# EAGLE design tetrad (EAGLE 7.7.0)

## Sheet 1 of 3: CPU
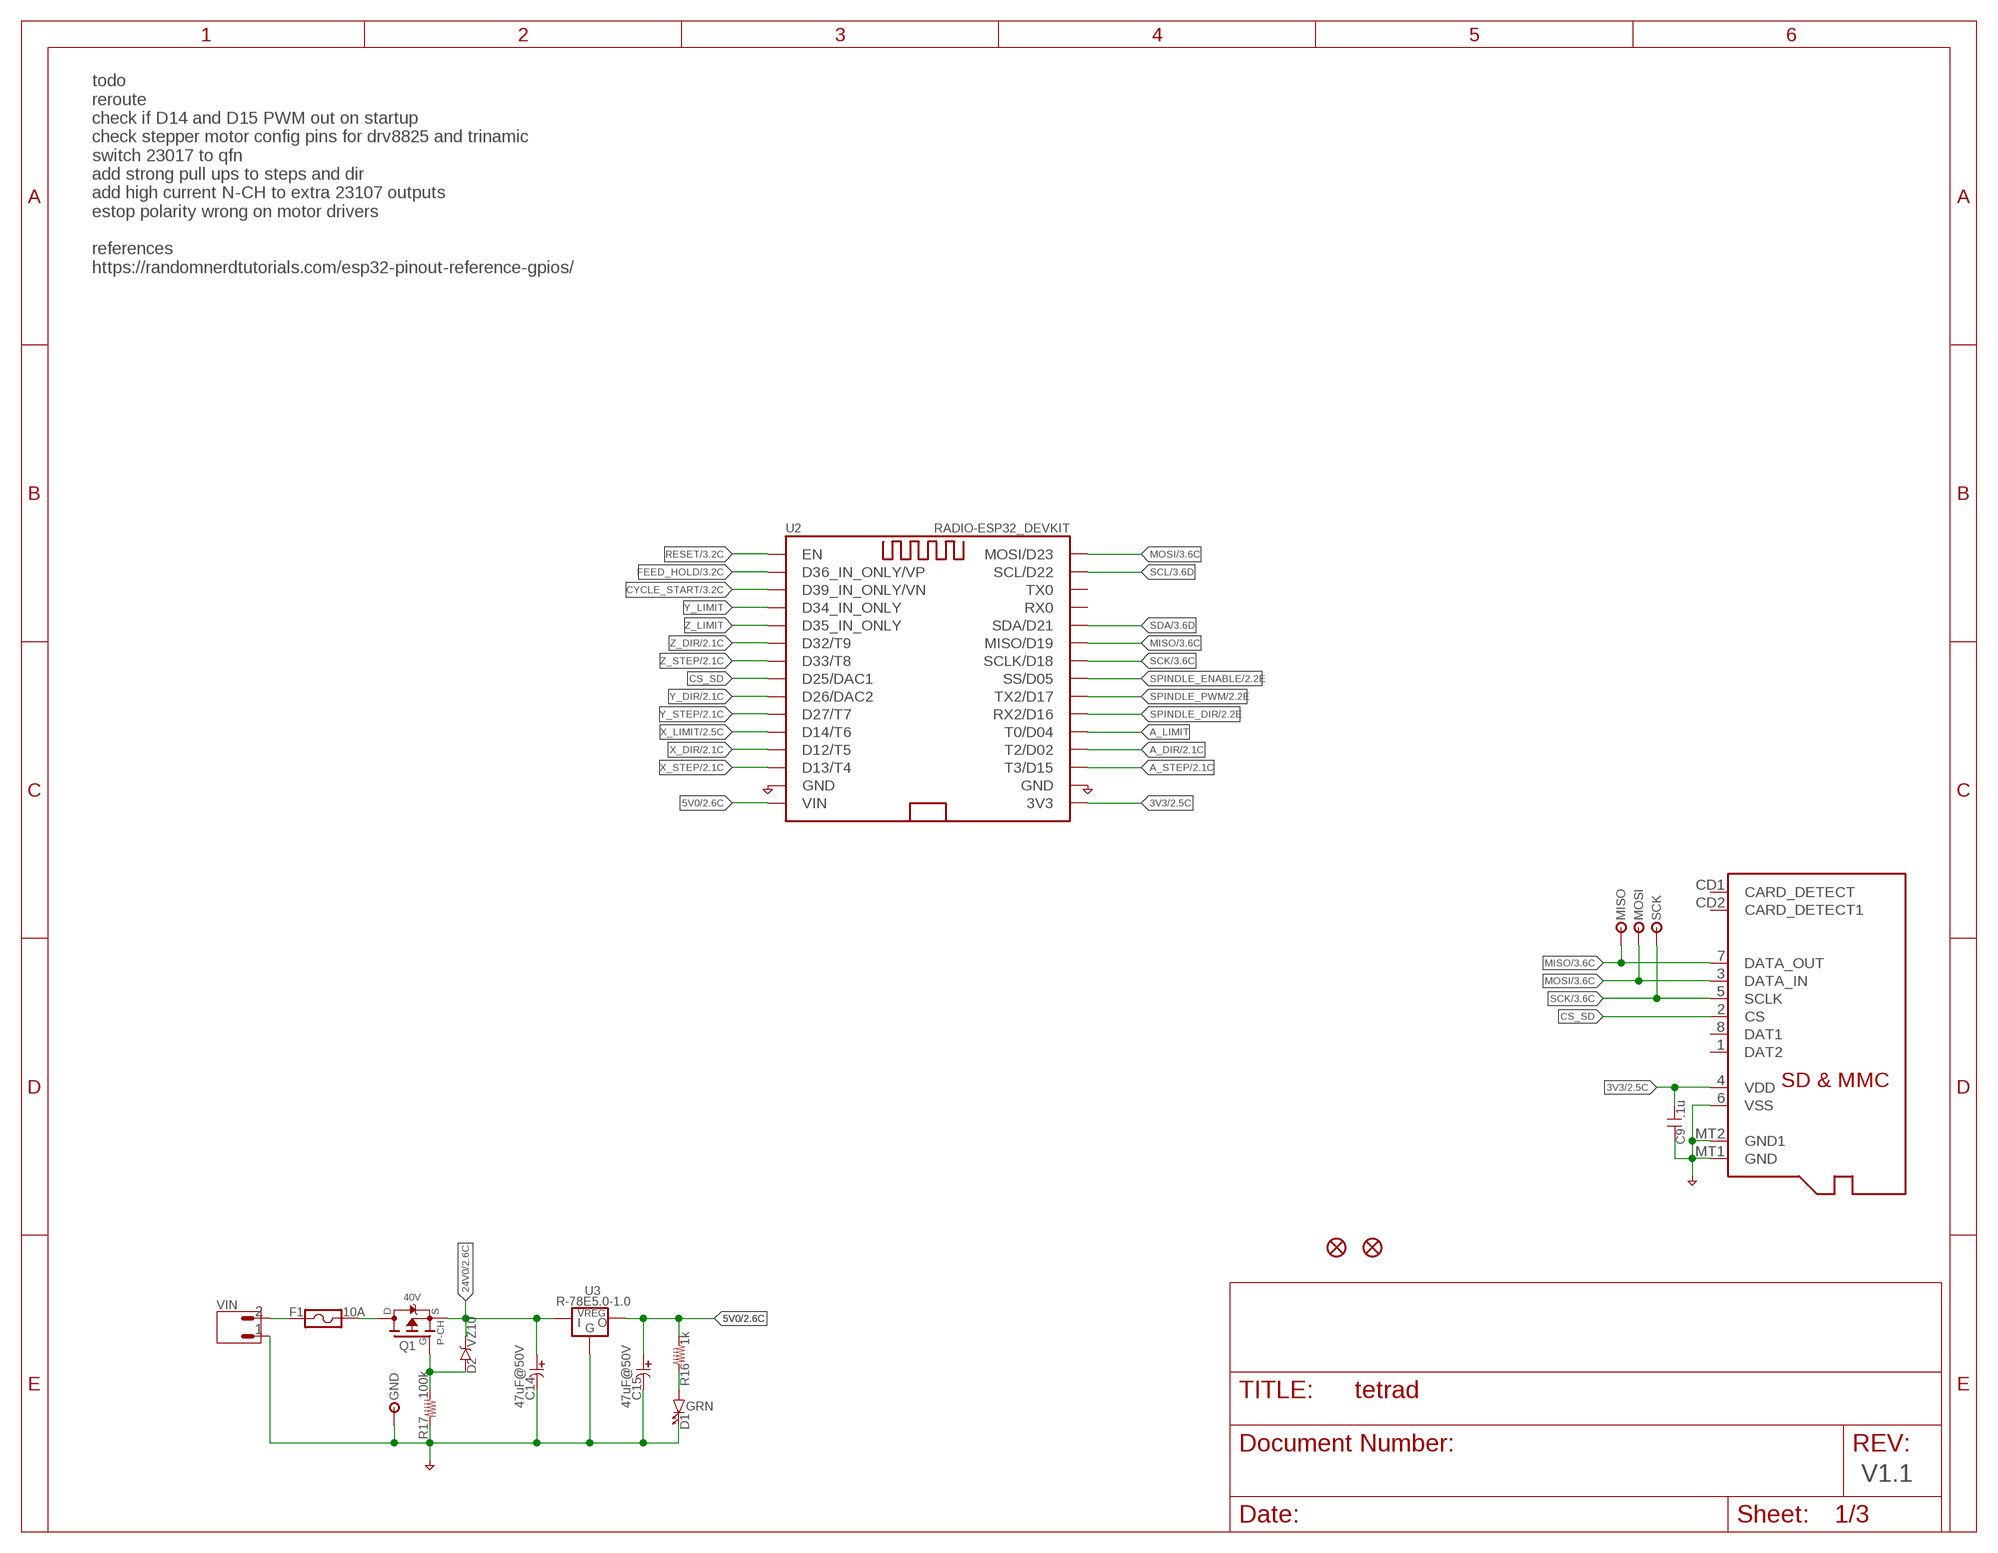
[diagram p0: schematic, sheet 1]

### Parts
C9  .1u  C-0603  [C-0603]
C14  47uF@50V  C-POLARIZED-E-6  [C-E-6]
C15  47uF@50V  C-POLARIZED-E-6  [C-E-6]
D1  GRN  LED-0603  [LED-0603]
D2  VZ10  DIODE-ZENER-SOD323  [D-SOD323]
F1  10A  FUSE-HOLDER-3557-2  [3557-2]
FID1  FIDUCIAL-MICRO  [FIDUCIAL-MICRO]
FID2  FIDUCIAL-MICRO  [FIDUCIAL-MICRO]
GND  TESTPOINTTHRU  [TPTHRU]
J1  CONN-MICROSD-2908-05WB-MG  [CONN-MICROSD-2908-05WB-MG]
MISO  TESTPOINTTHRU  [TPTHRU]
MOSI  TESTPOINTTHRU  [TPTHRU]
Q1  FET-PCH-TO252  [TO252]
R16  1k  R-0603  [R-0603]
R17  100k  R-0603  [R-0603]
SCK  TESTPOINTTHRU  [TPTHRU]
U2  RADIO-ESP32_DEVKIT  [ESP32_DEVKIT]
U3  R-78E5.0-1.0  VREG-SIP3  [VREG-SIP3]
VIN  CONN-02-3.81MM-PLUGIN-SCREW  [CONN-3.81MM-KF2EDG-2]

### Nets
3V3: C9.1 J1.4(VDD) U2.3V3 ; also sheet 2,3
5V0: C15.+ R16.2 U2.VIN U3.3(VOUT) ; also sheet 2,3
24V0: C14.+ D2.C Q1.2(S) U3.1(VIN) ; also sheet 2,3
A_DIR: U2.D2(T2/D02) ; also sheet 2
A_LIMIT: U2.D4(T0/D04)
A_STEP: U2.D15(T3/D15) ; also sheet 2
CS_SD: J1.2(CS) U2.D25(D25/DAC1)
CYCLE_START: U2.VN(D39_IN_ONLY/VN) ; also sheet 3
FEED_HOLD: U2.VP(D36_IN_ONLY/VP) ; also sheet 3
GND: C9.2 C14.- C15.- D1.C GND.1 J1.6(VSS) J1.MT1(GND) J1.MT2(GND1) R17.1 U2.GND@1(GND) U2.GND@2(GND) U3.2(GND) VIN.1 ; also sheet 2,3
MISO: J1.7(DATA_OUT) MISO.1 U2.D19(MISO/D19) ; also sheet 3
MOSI: J1.3(DATA_IN) MOSI.1 U2.D23(MOSI/D23) ; also sheet 3
N$1: F1.1@1 F1.1@2 VIN.2
N$24: D2.A Q1.1(G) R17.2
N$57: F1.2@1 F1.2@2 Q1.3(D)
N$84: D1.A R16.1
RESET: U2.EN ; also sheet 3
SCK: J1.5(SCLK) SCK.1 U2.D18(SCLK/D18) ; also sheet 3
SCL: U2.D22(SCL/D22) ; also sheet 3
SDA: U2.D21(SDA/D21) ; also sheet 3
SPINDLE_DIR: U2.RX2(RX2/D16) ; also sheet 2
SPINDLE_ENABLE: U2.D5(SS/D05) ; also sheet 2
SPINDLE_PWM: U2.TX2(TX2/D17) ; also sheet 2
X_DIR: U2.D12(D12/T5) ; also sheet 2
X_LIMIT: U2.D14(D14/T6) ; also sheet 2
X_STEP: U2.D13(D13/T4) ; also sheet 2
Y_DIR: U2.D26(D26/DAC2) ; also sheet 2
Y_LIMIT: U2.D34(D34_IN_ONLY)
Y_STEP: U2.D27(D27/T7) ; also sheet 2
Z_DIR: U2.D32(D32/T9) ; also sheet 2
Z_LIMIT: U2.D35(D35_IN_ONLY)
Z_STEP: U2.D33(D33/T8) ; also sheet 2
Unconnected: J1.1(DAT2) J1.8(DAT1) J1.CD1(CARD_DETECT) J1.CD2(CARD_DETECT1) U2.RX0 U2.TX0

### Notes on the sheet
- todo
  reroute
  check if D14 and D15 PWM out on startup
  check stepper motor config pins for drv8825 and trinamic
  switch 23017 to qfn
  add strong pull ups to steps and dir
  add high current N-CH to extra 23107 outputs
  estop polarity wrong on motor drivers
  
  references
  https://randomnerdtutorials.com/esp32-pinout-reference-gpios/
- 40V
- V1.1

## Sheet 2 of 3: MOTOR
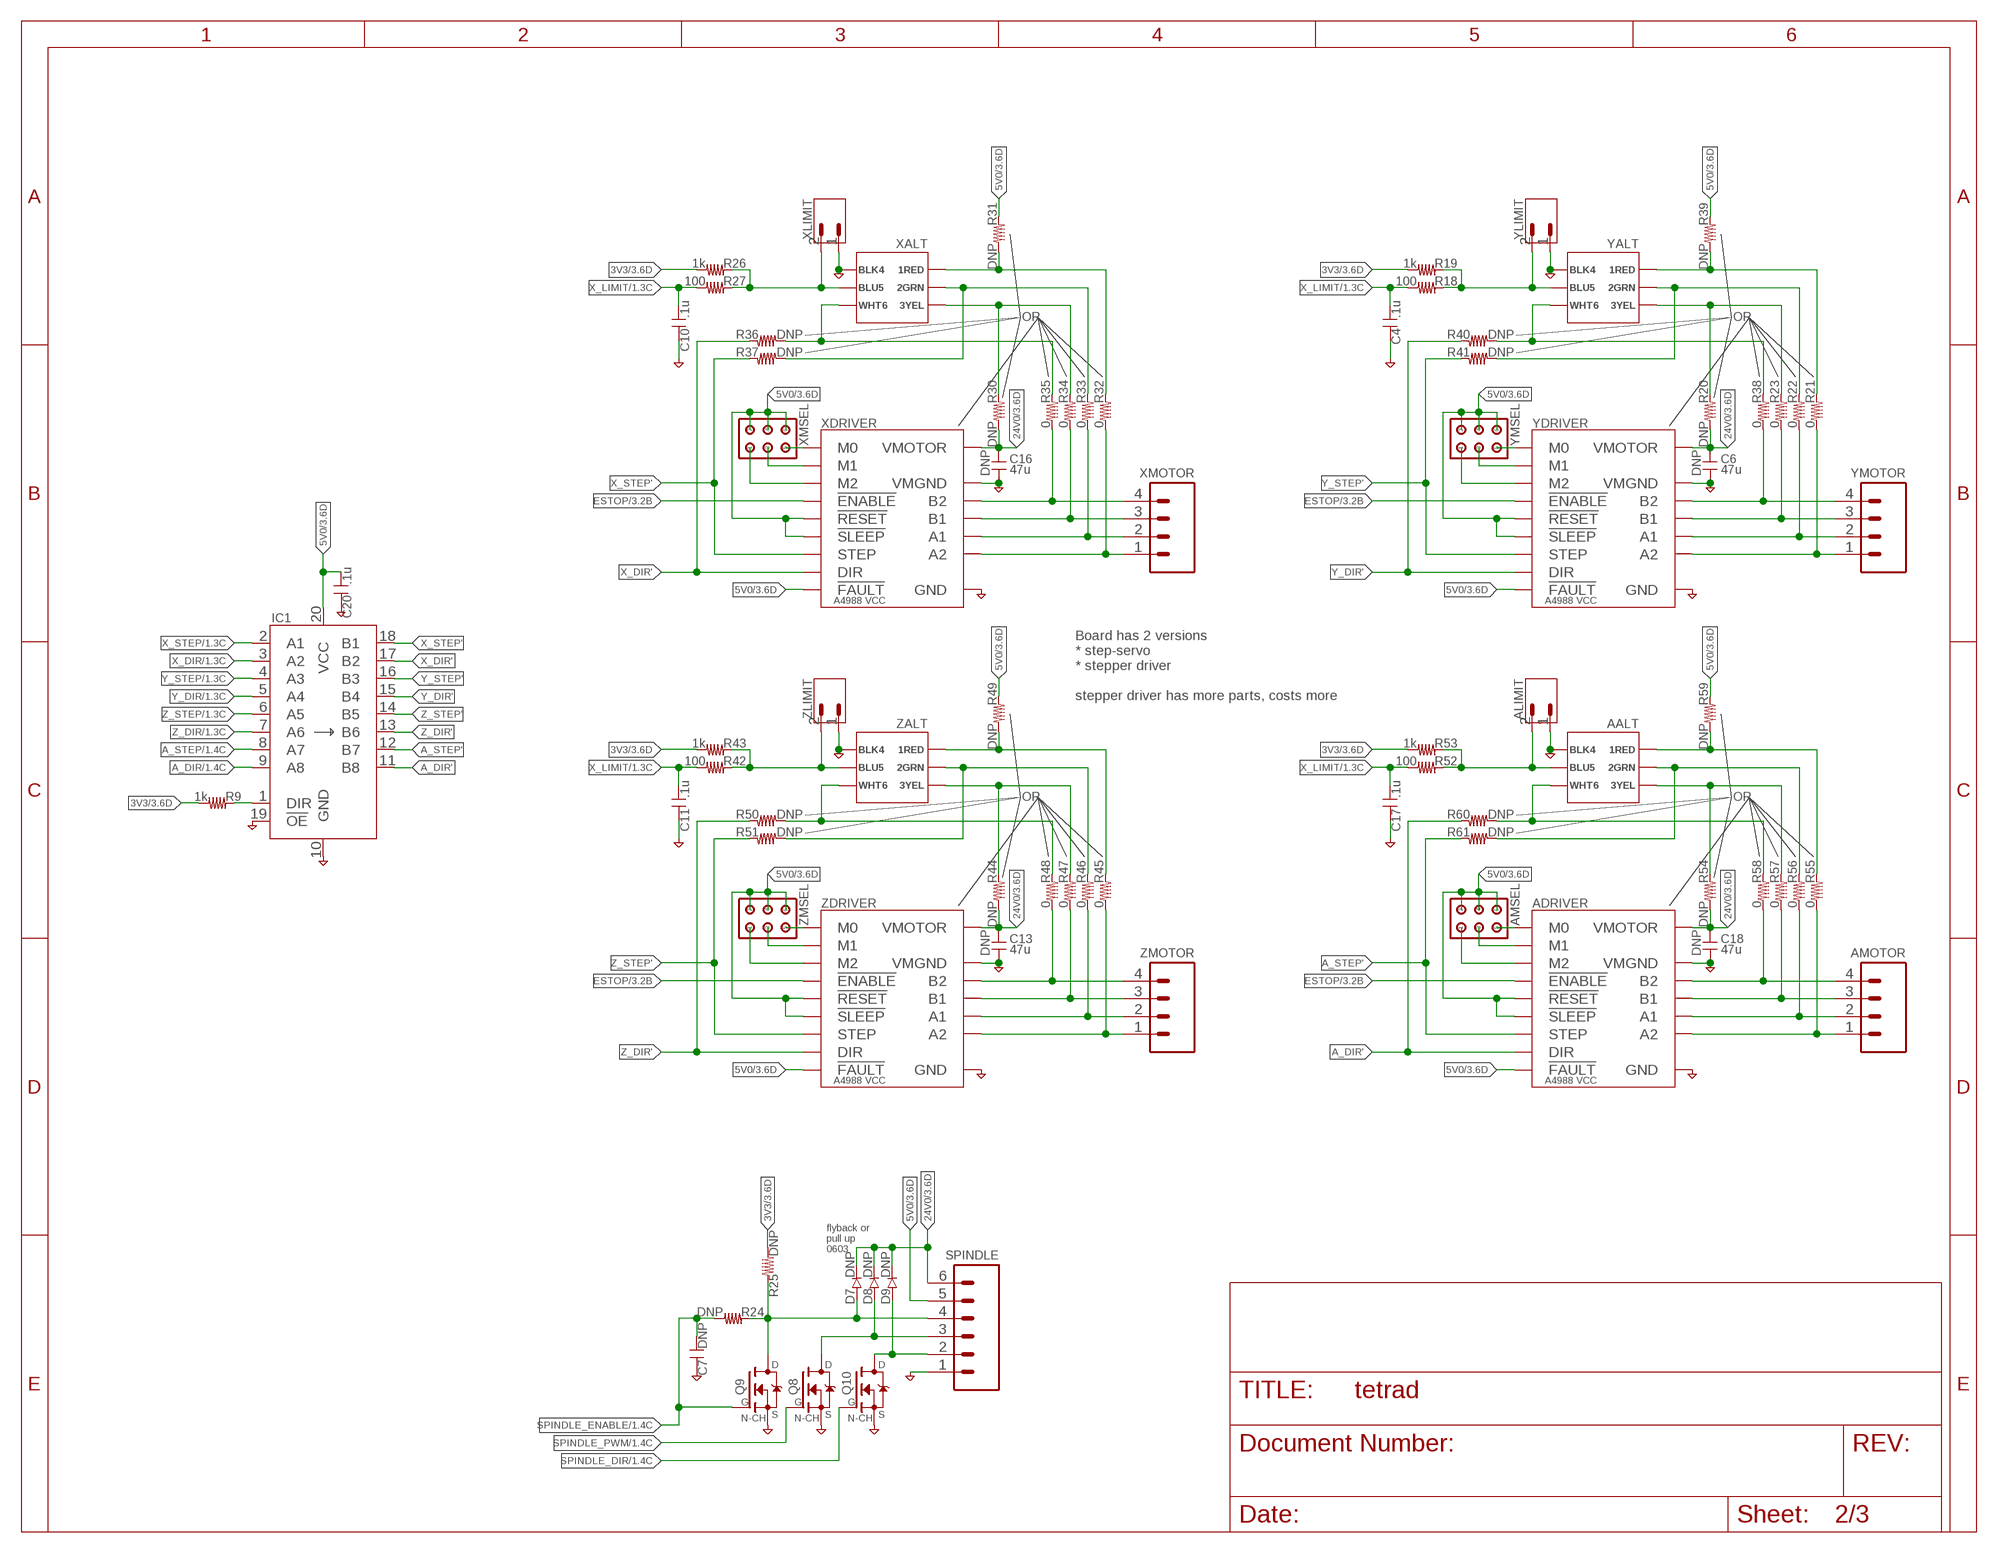
[diagram p1: schematic, sheet 2]

### Parts
AALT  CONN-03X2-MICROFIT-TH-SMD  [MOLEX_430450614_430450615]
ADRIVER  BOARD-DRV8825-CARRIER-TH-SMD  [IC_DRV8825_CARRIER_TH_SMD]
ALIMIT  CONN-02-.100-VERT-HEADER  [CONN-.100-2]
AMOTOR  CONN-04-.100-VERT-HEADER  [CONN-.100-4]
AMSEL  CONN-03X2-RH  [AMPHENOL_95278-101A06LF]
C4  .1u  C-0603  [C-0603]
C6  DNP  C-1206  [C-1206]
C7  DNP  C-0603  [C-0603]
C10  .1u  C-0603  [C-0603]
C11  .1u  C-0603  [C-0603]
C13  DNP  C-1206  [C-1206]
C16  DNP  C-1206  [C-1206]
C17  .1u  C-0603  [C-0603]
C18  DNP  C-1206  [C-1206]
C20  .1u  C-0603  [C-0603]
D7  DNP  DIODE-0603-SOD523  [D-SOD523]
D8  DNP  DIODE-0603-SOD523  [D-SOD523]
D9  DNP  DIODE-0603-SOD523  [D-SOD523]
IC1  74LS245DW  [SO20W]
Q8  FET-NCH-SOT23  [SOT23-3]
Q9  FET-NCH-SOT23  [SOT23-3]
Q10  FET-NCH-SOT23  [SOT23-3]
R9  1k  R-0603  [R-0603]
R18  100  R-0603  [R-0603]
R19  1k  R-0603  [R-0603]
R20  DNP  R-0603  [R-0603]
R21  0  R-0603  [R-0603]
R22  0  R-0603  [R-0603]
R23  0  R-0603  [R-0603]
R24  DNP  R-0603  [R-0603]
R25  DNP  R-0603  [R-0603]
R26  1k  R-0603  [R-0603]
R27  100  R-0603  [R-0603]
R30  DNP  R-0603  [R-0603]
R31  DNP  R-0603  [R-0603]
R32  0  R-0603  [R-0603]
R33  0  R-0603  [R-0603]
R34  0  R-0603  [R-0603]
R35  0  R-0603  [R-0603]
R36  DNP  R-0603  [R-0603]
R37  DNP  R-0603  [R-0603]
R38  0  R-0603  [R-0603]
R39  DNP  R-0603  [R-0603]
R40  DNP  R-0603  [R-0603]
R41  DNP  R-0603  [R-0603]
R42  100  R-0603  [R-0603]
R43  1k  R-0603  [R-0603]
R44  DNP  R-0603  [R-0603]
R45  0  R-0603  [R-0603]
R46  0  R-0603  [R-0603]
R47  0  R-0603  [R-0603]
R48  0  R-0603  [R-0603]
R49  DNP  R-0603  [R-0603]
R50  DNP  R-0603  [R-0603]
R51  DNP  R-0603  [R-0603]
R52  100  R-0603  [R-0603]
R53  1k  R-0603  [R-0603]
R54  DNP  R-0603  [R-0603]
R55  0  R-0603  [R-0603]
R56  0  R-0603  [R-0603]
R57  0  R-0603  [R-0603]
R58  0  R-0603  [R-0603]
R59  DNP  R-0603  [R-0603]
R60  DNP  R-0603  [R-0603]
R61  DNP  R-0603  [R-0603]
SPINDLE  CONN-06-.100-VERT-HEADER  [CONN-.100-6]
XALT  CONN-03X2-MICROFIT-TH-SMD  [MOLEX_430450614_430450615]
XDRIVER  BOARD-DRV8825-CARRIER-TH-SMD  [IC_DRV8825_CARRIER_TH_SMD]
XLIMIT  CONN-02-.100-VERT-HEADER  [CONN-.100-2]
XMOTOR  CONN-04-.100-VERT-HEADER  [CONN-.100-4]
XMSEL  CONN-03X2-RH  [AMPHENOL_95278-101A06LF]
YALT  CONN-03X2-MICROFIT-TH-SMD  [MOLEX_430450614_430450615]
YDRIVER  BOARD-DRV8825-CARRIER-TH-SMD  [IC_DRV8825_CARRIER_TH_SMD]
YLIMIT  CONN-02-.100-VERT-HEADER  [CONN-.100-2]
YMOTOR  CONN-04-.100-VERT-HEADER  [CONN-.100-4]
YMSEL  CONN-03X2-RH  [AMPHENOL_95278-101A06LF]
ZALT  CONN-03X2-MICROFIT-TH-SMD  [MOLEX_430450614_430450615]
ZDRIVER  BOARD-DRV8825-CARRIER-TH-SMD  [IC_DRV8825_CARRIER_TH_SMD]
ZLIMIT  CONN-02-.100-VERT-HEADER  [CONN-.100-2]
ZMOTOR  CONN-04-.100-VERT-HEADER  [CONN-.100-4]
ZMSEL  CONN-03X2-RH  [AMPHENOL_95278-101A06LF]

### Nets
3V3: R9.2 R19.2 R25.2 R26.2 R43.2 R53.2 ; also sheet 1,3
5V0: ADRIVER.5(!RESET) ADRIVER.5_(!RESET) ADRIVER.6(!SLEEP) ADRIVER.6_(!SLEEP) ADRIVER.10(!FAULT) ADRIVER.10_(!FAULT) AMSEL.2 AMSEL.4 AMSEL.6 C20.1 IC1.20(VCC) R31.1 R39.1 R49.1 R59.1 SPINDLE.5 XDRIVER.5(!RESET) XDRIVER.5_(!RESET) XDRIVER.6(!SLEEP) XDRIVER.6_(!SLEEP) XDRIVER.10(!FAULT) XDRIVER.10_(!FAULT) XMSEL.2 XMSEL.4 XMSEL.6 YDRIVER.5(!RESET) YDRIVER.5_(!RESET) YDRIVER.6(!SLEEP) YDRIVER.6_(!SLEEP) YDRIVER.10(!FAULT) YDRIVER.10_(!FAULT) YMSEL.2 YMSEL.4 YMSEL.6 ZDRIVER.5(!RESET) ZDRIVER.5_(!RESET) ZDRIVER.6(!SLEEP) ZDRIVER.6_(!SLEEP) ZDRIVER.10(!FAULT) ZDRIVER.10_(!FAULT) ZMSEL.2 ZMSEL.4 ZMSEL.6 ; also sheet 1,3
24V0: ADRIVER.16(VMOTOR) ADRIVER.16_(VMOTOR) C6.1 C13.1 C16.1 C18.1 D7.C D8.C D9.C R20.2 R30.2 R44.2 R54.2 SPINDLE.6 XDRIVER.16(VMOTOR) XDRIVER.16_(VMOTOR) YDRIVER.16(VMOTOR) YDRIVER.16_(VMOTOR) ZDRIVER.16(VMOTOR) ZDRIVER.16_(VMOTOR) ; also sheet 1,3
A_DIR: IC1.9(A8) ; also sheet 1
A_DIR': ADRIVER.8(DIR) ADRIVER.8_(DIR) IC1.11(B8) R60.1
A_STEP: IC1.8(A7) ; also sheet 1
A_STEP': ADRIVER.7(STEP) ADRIVER.7_(STEP) IC1.12(B7) R61.1
ESTOP: ADRIVER.1(!ENABLE) ADRIVER.1_(!ENABLE) XDRIVER.1(!ENABLE) XDRIVER.1_(!ENABLE) YDRIVER.1(!ENABLE) YDRIVER.1_(!ENABLE) ZDRIVER.1(!ENABLE) ZDRIVER.1_(!ENABLE) ; also sheet 3
GND: AALT.4 AALT.4_ ADRIVER.9(GND) ADRIVER.9_(GND) ADRIVER.15(VMGND) ADRIVER.15_(VMGND) ALIMIT.1 C4.2 C6.2 C7.2 C10.2 C11.2 C13.2 C16.2 C17.2 C18.2 C20.2 IC1.10(GND) IC1.19(!OE) Q8.2(S) Q9.2(S) Q10.2(S) SPINDLE.1 XALT.4 XALT.4_ XDRIVER.9(GND) XDRIVER.9_(GND) XDRIVER.15(VMGND) XDRIVER.15_(VMGND) XLIMIT.1 YALT.4 YALT.4_ YDRIVER.9(GND) YDRIVER.9_(GND) YDRIVER.15(VMGND) YDRIVER.15_(VMGND) YLIMIT.1 ZALT.4 ZALT.4_ ZDRIVER.9(GND) ZDRIVER.9_(GND) ZDRIVER.15(VMGND) ZDRIVER.15_(VMGND) ZLIMIT.1 ; also sheet 1,3
N$2: R30.1 R34.1 XALT.3 XALT.3_
N$3: IC1.1(DIR) R9.1
N$5: R31.2 R32.1 XALT.1 XALT.1_
N$6: R21.2 YDRIVER.11(A2) YDRIVER.11_(A2) YMOTOR.1
N$7: YDRIVER.2(M0) YDRIVER.2_(M0) YMSEL.5
N$8: YDRIVER.3(M1) YDRIVER.3_(M1) YMSEL.3
N$9: YDRIVER.4(M2) YDRIVER.4_(M2) YMSEL.1
N$10: R22.2 YDRIVER.12(A1) YDRIVER.12_(A1) YMOTOR.2
N$11: R23.2 YDRIVER.13(B1) YDRIVER.13_(B1) YMOTOR.3
N$13: D7.A Q9.3(D) R24.1 R25.1 SPINDLE.4
N$14: D9.A Q10.3(D) SPINDLE.2
N$21: R38.2 YDRIVER.14(B2) YDRIVER.14_(B2) YMOTOR.4
N$25: R32.2 XDRIVER.11(A2) XDRIVER.11_(A2) XMOTOR.1
N$31: R18.1 R19.1 YALT.5 YALT.5_ YLIMIT.2
N$33: XDRIVER.2(M0) XDRIVER.2_(M0) XMSEL.5
N$34: XDRIVER.3(M1) XDRIVER.3_(M1) XMSEL.3
N$35: XDRIVER.4(M2) XDRIVER.4_(M2) XMSEL.1
N$36: R38.1 R40.2 YALT.6 YALT.6_
N$37: R21.1 R39.2 YALT.1 YALT.1_
N$38: R20.1 R23.1 YALT.3 YALT.3_
N$39: R45.2 ZDRIVER.11(A2) ZDRIVER.11_(A2) ZMOTOR.1
N$40: ZDRIVER.2(M0) ZDRIVER.2_(M0) ZMSEL.5
N$41: ZDRIVER.3(M1) ZDRIVER.3_(M1) ZMSEL.3
N$42: ZDRIVER.4(M2) ZDRIVER.4_(M2) ZMSEL.1
N$43: R46.2 ZDRIVER.12(A1) ZDRIVER.12_(A1) ZMOTOR.2
N$45: R47.2 ZDRIVER.13(B1) ZDRIVER.13_(B1) ZMOTOR.3
N$46: R48.2 ZDRIVER.14(B2) ZDRIVER.14_(B2) ZMOTOR.4
N$47: R42.1 R43.1 ZALT.5 ZALT.5_ ZLIMIT.2
N$48: R48.1 R50.2 ZALT.6 ZALT.6_
N$49: R45.1 R49.2 ZALT.1 ZALT.1_
N$50: R44.1 R47.1 ZALT.3 ZALT.3_
N$51: ADRIVER.11(A2) ADRIVER.11_(A2) AMOTOR.1 R55.2
N$56: R35.2 XDRIVER.14(B2) XDRIVER.14_(B2) XMOTOR.4
N$58: R26.1 R27.1 XALT.5 XALT.5_ XLIMIT.2
N$59: ADRIVER.2(M0) ADRIVER.2_(M0) AMSEL.5
N$60: R35.1 R36.2 XALT.6 XALT.6_
N$61: ADRIVER.3(M1) ADRIVER.3_(M1) AMSEL.3
N$62: R33.2 XDRIVER.12(A1) XDRIVER.12_(A1) XMOTOR.2
N$63: R34.2 XDRIVER.13(B1) XDRIVER.13_(B1) XMOTOR.3
N$64: ADRIVER.4(M2) ADRIVER.4_(M2) AMSEL.1
N$65: ADRIVER.12(A1) ADRIVER.12_(A1) AMOTOR.2 R56.2
N$66: ADRIVER.13(B1) ADRIVER.13_(B1) AMOTOR.3 R57.2
N$67: ADRIVER.14(B2) ADRIVER.14_(B2) AMOTOR.4 R58.2
N$68: AALT.5 AALT.5_ ALIMIT.2 R52.1 R53.1
N$69: AALT.6 AALT.6_ R58.1 R60.2
N$70: AALT.1 AALT.1_ R55.1 R59.2
N$71: AALT.3 AALT.3_ R54.1 R57.1
SPINDLE_DIR: Q10.1(G) ; also sheet 1
SPINDLE_ENABLE: C7.1 Q9.1(G) R24.2 ; also sheet 1
SPINDLE_PWM: Q8.1(G) ; also sheet 1
X_DIR: IC1.3(A2) ; also sheet 1
X_DIR': IC1.17(B2) R36.1 XDRIVER.8(DIR) XDRIVER.8_(DIR)
X_LIMIT: C4.1 C10.1 C11.1 C17.1 R18.2 R27.2 R42.2 R52.2 ; also sheet 1
X_STEP: IC1.2(A1) ; also sheet 1
X_STEP': IC1.18(B1) R22.1 R33.1 R37.1 R37.2 R41.2 R46.1 R51.2 XALT.2 XALT.2_ XDRIVER.7(STEP) XDRIVER.7_(STEP) YALT.2 YALT.2_ ZALT.2 ZALT.2_
X_STEP'1: AALT.2 AALT.2_ R56.1 R61.2
X_STEP_5V4: D8.A Q8.3(D) SPINDLE.3
Y_DIR: IC1.5(A4) ; also sheet 1
Y_DIR': IC1.15(B4) R40.1 YDRIVER.8(DIR) YDRIVER.8_(DIR)
Y_STEP: IC1.4(A3) ; also sheet 1
Y_STEP': IC1.16(B3) R41.1 YDRIVER.7(STEP) YDRIVER.7_(STEP)
Z_DIR: IC1.7(A6) ; also sheet 1
Z_DIR': IC1.13(B6) R50.1 ZDRIVER.8(DIR) ZDRIVER.8_(DIR)
Z_STEP: IC1.6(A5) ; also sheet 1
Z_STEP': IC1.14(B5) R51.1 ZDRIVER.7(STEP) ZDRIVER.7_(STEP)

### Notes on the sheet
- OR | OR
- 47u | 47u
- Board has 2 versions
  * step-servo
  * stepper driver
  
  stepper driver has more parts, costs more
- OR | OR
- 47u | 47u
- flyback or
  pull up 
  0603

## Sheet 3 of 3: EXTERNAL
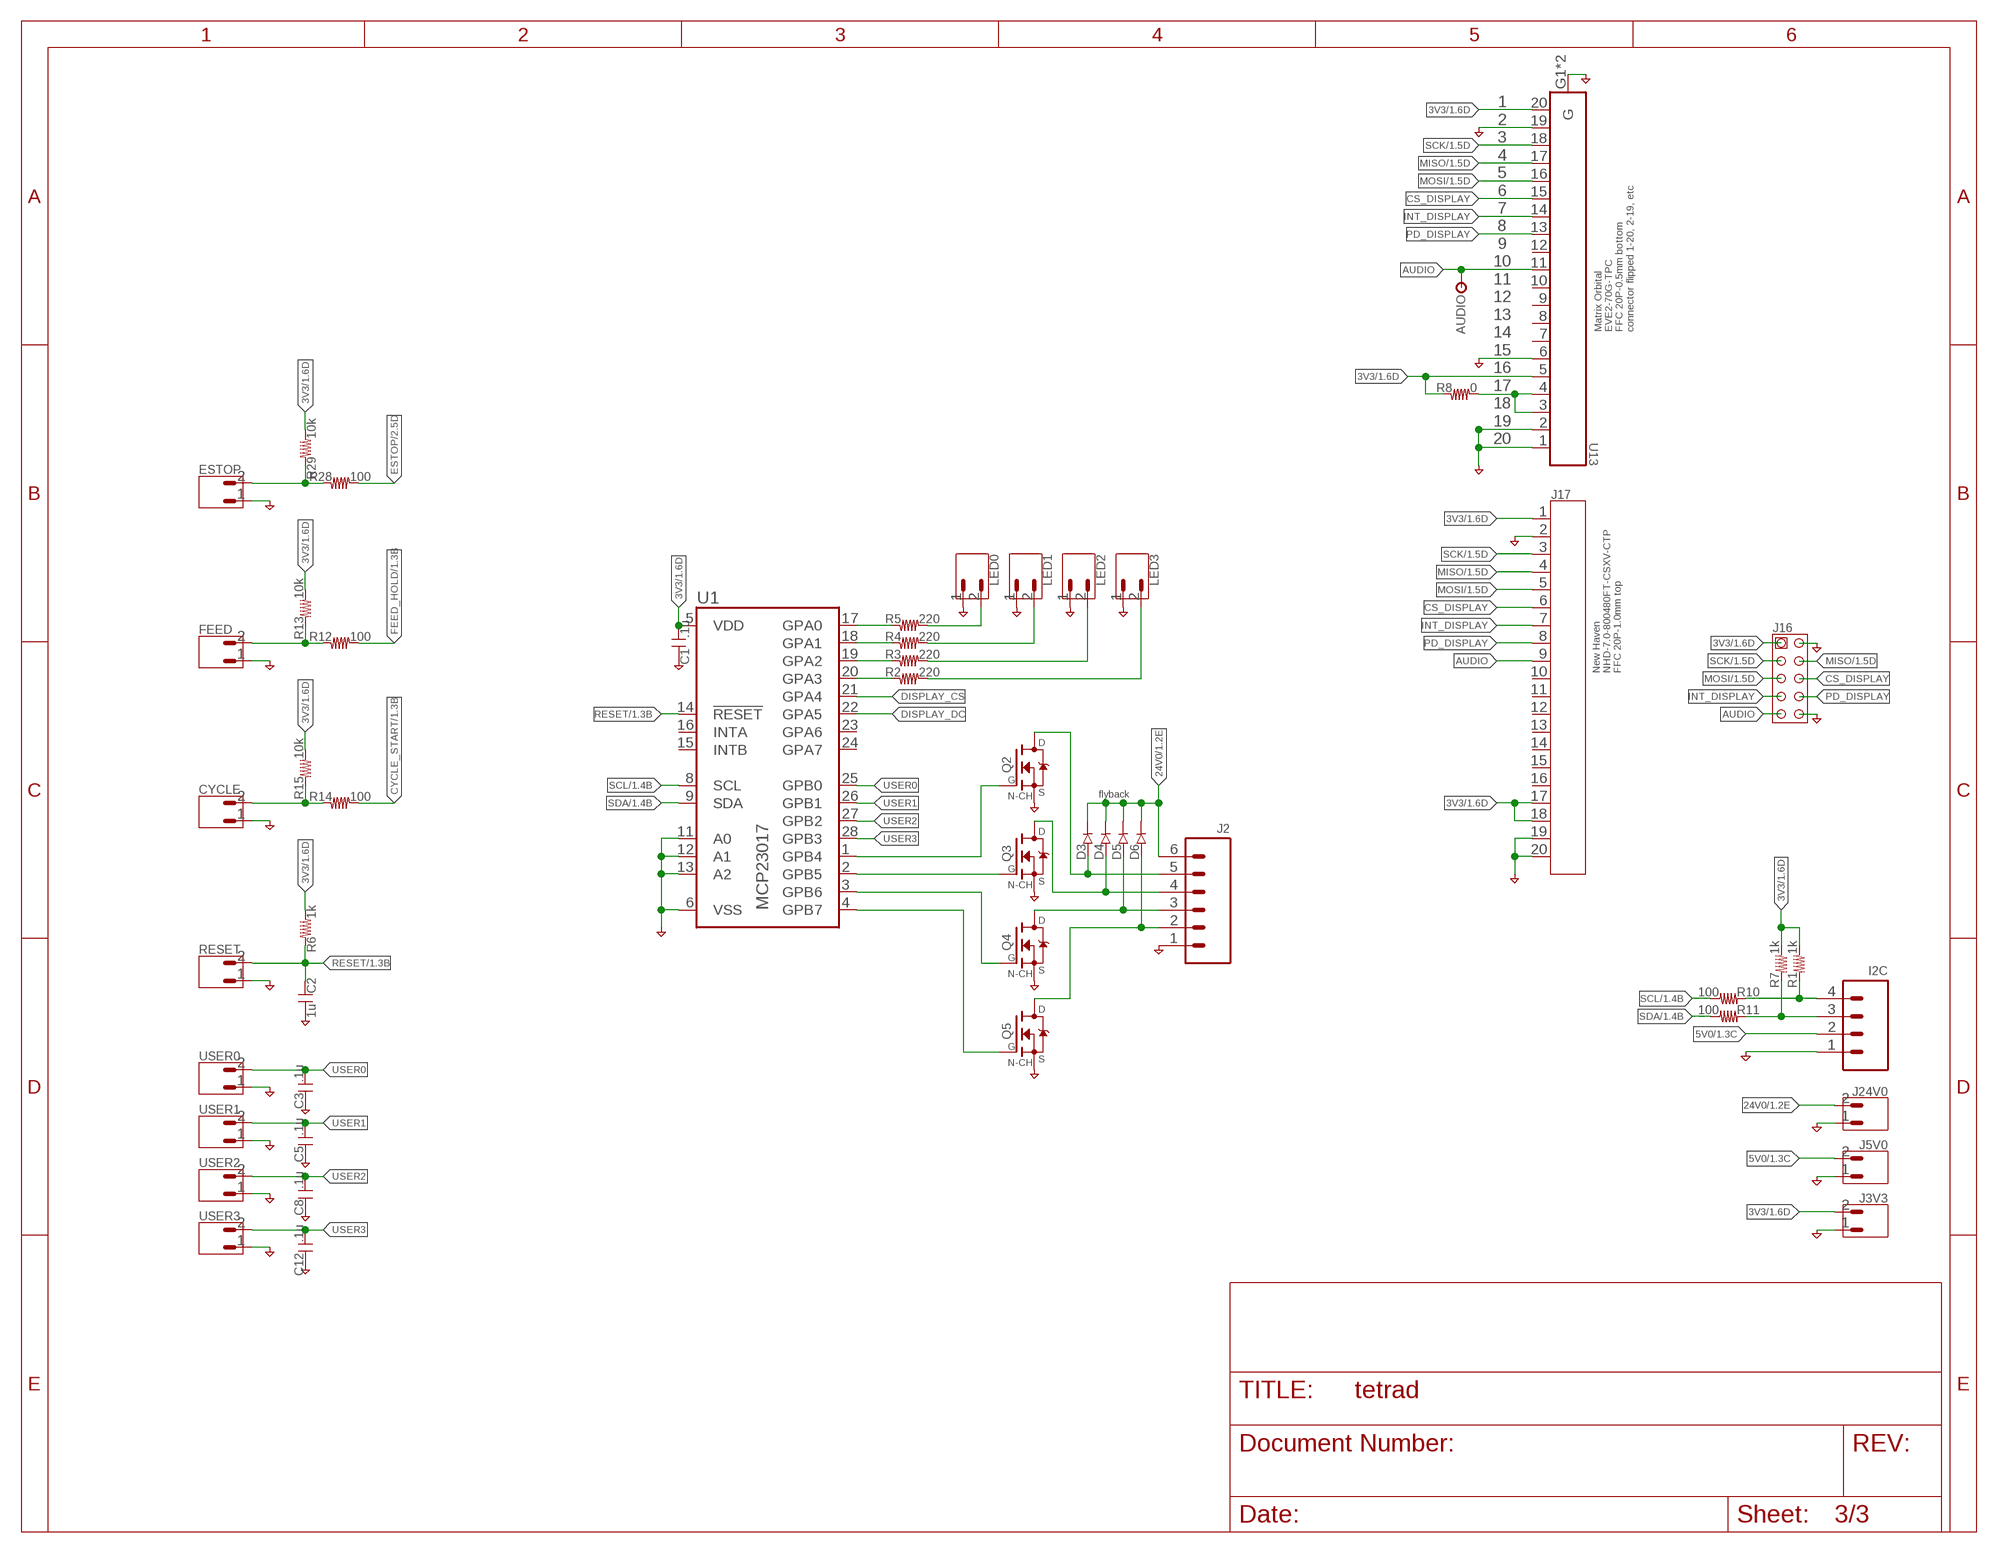
[diagram p2: schematic, sheet 3]

### Parts
AUDIO  TESTPOINTTHRU  [TPTHRU]
C1  .1u  C-0603  [C-0603]
C2  1u  C-0603  [C-0603]
C3  .1u  C-0603  [C-0603]
C5  .1u  C-0603  [C-0603]
C8  .1u  C-0603  [C-0603]
C12  .1u  C-0603  [C-0603]
CYCLE  CONN-02-.100-VERT-HEADER  [CONN-.100-2]
D3  DIODE-0603-SOD523  [D-SOD523]
D4  DIODE-0603-SOD523  [D-SOD523]
D5  DIODE-0603-SOD523  [D-SOD523]
D6  DIODE-0603-SOD523  [D-SOD523]
ESTOP  CONN-02-.100-VERT-HEADER  [CONN-.100-2]
FEED  CONN-02-.100-VERT-HEADER  [CONN-.100-2]
I2C  CONN-04-.100-VERT-HEADER  [CONN-.100-4]
J2  CONN-06-3.81MM-PLUGIN-SCREW  [CONN-3.81MM-KF2EDG-6]
J3V3  CONN-02-.100-VERT-HEADER  [CONN-.100-2]
J5V0  CONN-02-.100-VERT-HEADER  [CONN-.100-2]
J16  CONN-05X2-SHD  [2X5-SHROUDED]
J17  CONN-20-2-84952-0  [CON20_SMT-RA_FCC-FPC2]
J24V0  CONN-02-.100-VERT-HEADER  [CONN-.100-2]
LED0  CONN-02-.100-VERT-HEADER  [CONN-.100-2]
LED1  CONN-02-.100-VERT-HEADER  [CONN-.100-2]
LED2  CONN-02-.100-VERT-HEADER  [CONN-.100-2]
LED3  CONN-02-.100-VERT-HEADER  [CONN-.100-2]
Q2  FET-NCH-TO252  [TO252]
Q3  FET-NCH-TO252  [TO252]
Q4  FET-NCH-TO252  [TO252]
Q5  FET-NCH-TO252  [TO252]
R1  1k  R-0603  [R-0603]
R2  220  R-0603  [R-0603]
R3  220  R-0603  [R-0603]
R4  220  R-0603  [R-0603]
R5  220  R-0603  [R-0603]
R6  1k  R-0603  [R-0603]
R7  1k  R-0603  [R-0603]
R8  0  R-0603  [R-0603]
R10  100  R-0603  [R-0603]
R11  100  R-0603  [R-0603]
R12  100  R-0603  [R-0603]
R13  10k  R-0603  [R-0603]
R14  100  R-0603  [R-0603]
R15  10k  R-0603  [R-0603]
R28  100  R-0603  [R-0603]
R29  10k  R-0603  [R-0603]
RESET  CONN-02-.100-VERT-HEADER  [CONN-.100-2]
U1  IO-MCP23017ML  [QFN28-ML_6X6MM]
U13  CONN-20-FPC-0.50MM-10051922-2010ELF  [FCI_10051922-2010ELF]
USER0  CONN-02-.100-VERT-HEADER  [CONN-.100-2]
USER1  CONN-02-.100-VERT-HEADER  [CONN-.100-2]
USER2  CONN-02-.100-VERT-HEADER  [CONN-.100-2]
USER3  CONN-02-.100-VERT-HEADER  [CONN-.100-2]

### Nets
3V3: C1.1 J3V3.2 J16.1 J17.1 J17.17 J17.18 R1.2 R6.2 R7.2 R8.1 R13.2 R15.2 R29.2 U1.5(VDD) U13.5 U13.20 ; also sheet 1,2
5V0: I2C.2 J5V0.2 ; also sheet 1,2
24V0: D3.C D4.C D5.C D6.C J2.6 J24V0.2 ; also sheet 1,2
AUDIO: AUDIO.1 J16.9 J17.9 U13.11
CS_DISPLAY: J16.6 J17.6 U13.15
CYCLE_START: R14.2 ; also sheet 1
DISPLAY_CS: U1.21(GPA4)
DISPLAY_DC: U1.22(GPA5)
ESTOP: ESTOP.2 R28.1 R29.1 ; also sheet 2
FEED_HOLD: R12.2 ; also sheet 1
GND: C1.2 C2.1 C3.2 C5.2 C8.2 C12.2 CYCLE.1 ESTOP.1 FEED.1 I2C.1 J2.1 J3V3.1 J5V0.1 J16.2 J16.10 J17.2 J17.19 J17.20 J24V0.1 LED0.1 LED1.1 LED2.1 LED3.1 Q2.2(S) Q3.2(S) Q4.2(S) Q5.2(S) RESET.1 U1.6(VSS) U1.11(A0) U1.12(A1) U1.13(A2) U13.1 U13.2 U13.6 U13.19 U13.G1(G) U13.G2(G) USER0.1 USER1.1 USER2.1 USER3.1 ; also sheet 1,2
INT_DISPLAY: J16.7 J17.7 U13.14
MISO: J16.4 J17.4 U13.17 ; also sheet 1
MOSI: J16.5 J17.5 U13.16 ; also sheet 1
N$4: R28.2
N$12: R5.1 U1.17(GPA0)
N$15: R4.1 U1.18(GPA1)
N$16: FEED.2 R12.1 R13.1
N$17: CYCLE.2 R14.1 R15.1
N$18: I2C.4 R1.1 R10.1
N$19: I2C.3 R7.1 R11.1
N$20: D6.A J2.2 Q5.3(D)
N$22: R3.1 U1.19(GPA2)
N$23: R2.1 U1.20(GPA3)
N$26: LED3.2 R2.2
N$27: LED2.2 R3.2
N$28: LED1.2 R4.2
N$29: LED0.2 R5.2
N$30: D5.A J2.3 Q4.3(D)
N$32: D4.A J2.4 Q3.3(D)
N$44: D3.A J2.5 Q2.3(D)
N$52: Q2.1(G) U1.1(GPB4)
N$53: Q3.1(G) U1.2(GPB5)
N$54: Q4.1(G) U1.3(GPB6)
N$55: Q5.1(G) U1.4(GPB7)
N$108: R8.2 U13.3 U13.4
PD_DISPLAY: J16.8 J17.8 U13.13
RESET: C2.2 R6.1 RESET.2 U1.14(!RESET) ; also sheet 1
SCK: J16.3 J17.3 U13.18 ; also sheet 1
SCL: R10.2 U1.8(SCL) ; also sheet 1
SDA: R11.2 U1.9(SDA) ; also sheet 1
USER0: C3.1 U1.25(GPB0) USER0.2
USER1: C5.1 U1.26(GPB1) USER1.2
USER2: C8.1 U1.27(GPB2) USER2.2
USER3: C12.1 U1.28(GPB3) USER3.2
Unconnected: J17.10 J17.11 J17.12 J17.13 J17.14 J17.15 J17.16 U1.15(INTB) U1.16(INTA) U1.23(GPA6) U1.24(GPA7) U13.7 U13.8 U13.9 U13.10 U13.12

### Notes on the sheet
- 1
  2
  3
  4
  5
  6
  7
  8
  9
  10
  11
  12
  13
  14
  15
  16
  17
  18
  19
  20
- Matrix Orbital
  EVE2-70G-TPC
  FFC 20P-0.5mm bottom
  connector flipped 1-20, 2-19, etc
- New Haven
  NHD-7.0-800480FT-CSXV-CTP
  FFC 20P-1.0mm top
- flyback

## Library data of the parts
AALT XALT YALT ZALT = holla:CONN-03X2-MICROFIT: Conn Power HDR 6 POS 3mm Solder ST Thru-Hole 6 Terminal 1 Port Micro-Fit 3.0Ã¢â¢ Tray
ADRIVER XDRIVER YDRIVER ZDRIVER = holla:BOARD-DRV8825-CARRIER: Stepper motor controler; IC: DRV8825; 1.5A; Uin mot: 8.2÷45V Amphenol 91601-308LF Sullins NPTC081KFXC-RC or NPPC081KFXC-RC; AVAILABILITY: Unavailable; DESCRIPTION: Stepper motor controler; IC: DRV8825; 1.5A; Uin mot: 8.2÷45V; MF: Pololu; MP: DRV8825 STEPPER MOTOR DRIVER CARRIER; PACKAGE: None; PRICE: None
ALIMIT CYCLE ESTOP FEED J3V3 J5V0 J24V0 LED0 LED1-LED3 RESET USER0 USER1-USER3 VIN XLIMIT YLIMIT ZLIMIT = holla:CONN-02: CONN HEADER 2POS
AMOTOR I2C XMOTOR YMOTOR ZMOTOR = holla:CONN-04
AMSEL XMSEL YMSEL ZMSEL = holla:CONN-03X2
AUDIO GND MISO MOSI SCK = holla:TESTPOINT; DNP: 1
C1-C13 C16-C18 C20 = holla:C
C14 C15 = holla:C-POLARIZED
D1 = holla:LED
D2 = holla:DIODE-ZENER
D3-D9 = holla:DIODE
F1 = holla:FUSE-HOLDER
FID1 FID2 = holla:FIDUCIAL: Fiducial Alignment Points Various fiducial points for machine vision alignment.; DNP: 1
IC1 = holla:74*245: Octal BUS TRANSCEIVER, 3-state
J1 = holla:CONN-MICROSD-2908-05WB-MG: Micro-SD / Transflash card holder with SPI pinout For the 3M # 2908-05WB-MG and/or 4UCON #19656 push-push type also Amphenol - 101-00660-68-6
J2 SPINDLE = holla:CONN-06
J16 = holla:CONN-05X2: Header 5x2 Standard 10-pin dual row 0.1" header. Commonly used with AVR-ISP. Use with Spark Fun Electronics SKU: PRT-00778; DNI: 1
J17 = holla:CONN-20-2-84952-0: TE 2-84952-0 CONN FPC BOTTOM 20POS 1.00MM R/A A100319CT-ND; MANUFACTURER_PART_NUMBER: 2849520; VENDOR: TE Connectivity
Q1 = holla:FET-PCH
Q2-Q5 Q8-Q10 = holla:FET-NCH
R1-R61 = holla:R
U1 = holla:IO-MCP23017: 16-bit input/output port expander with interrupt output http://ww1.microchip.com/downloads/en/DeviceDoc/21952a.pdf Source: http://ww1.microchip.com/downloads/en/DeviceDoc/21952a.pdf; MF: MICROCHIP; MPN: MCP23017-E/ML; OC_FARNELL: unknown; OC_NEWARK: 31K2957
U2 = holla:RADIO-ESP32_DEVKIT: ESP32 DEVKIT BOARD
U3 = holla:VREG: Various 3 pin voltage regulators in different packages Double check the right pinout for the right part
U13 = holla:CONN-20-FPC-0.50MM: FFC/FPC CONNECTOR, 20POS, 1ROW; AVAILABILITY: Unavailable; DESCRIPTION: 20 Position FPC Connector Contacts, Bottom 0.020 _0.50mm_ Surface Mount, Right Angle; MF: Amphenol ICC; MP: 10051922-2010ELF; PACKAGE: None; PRICE: None

## Board
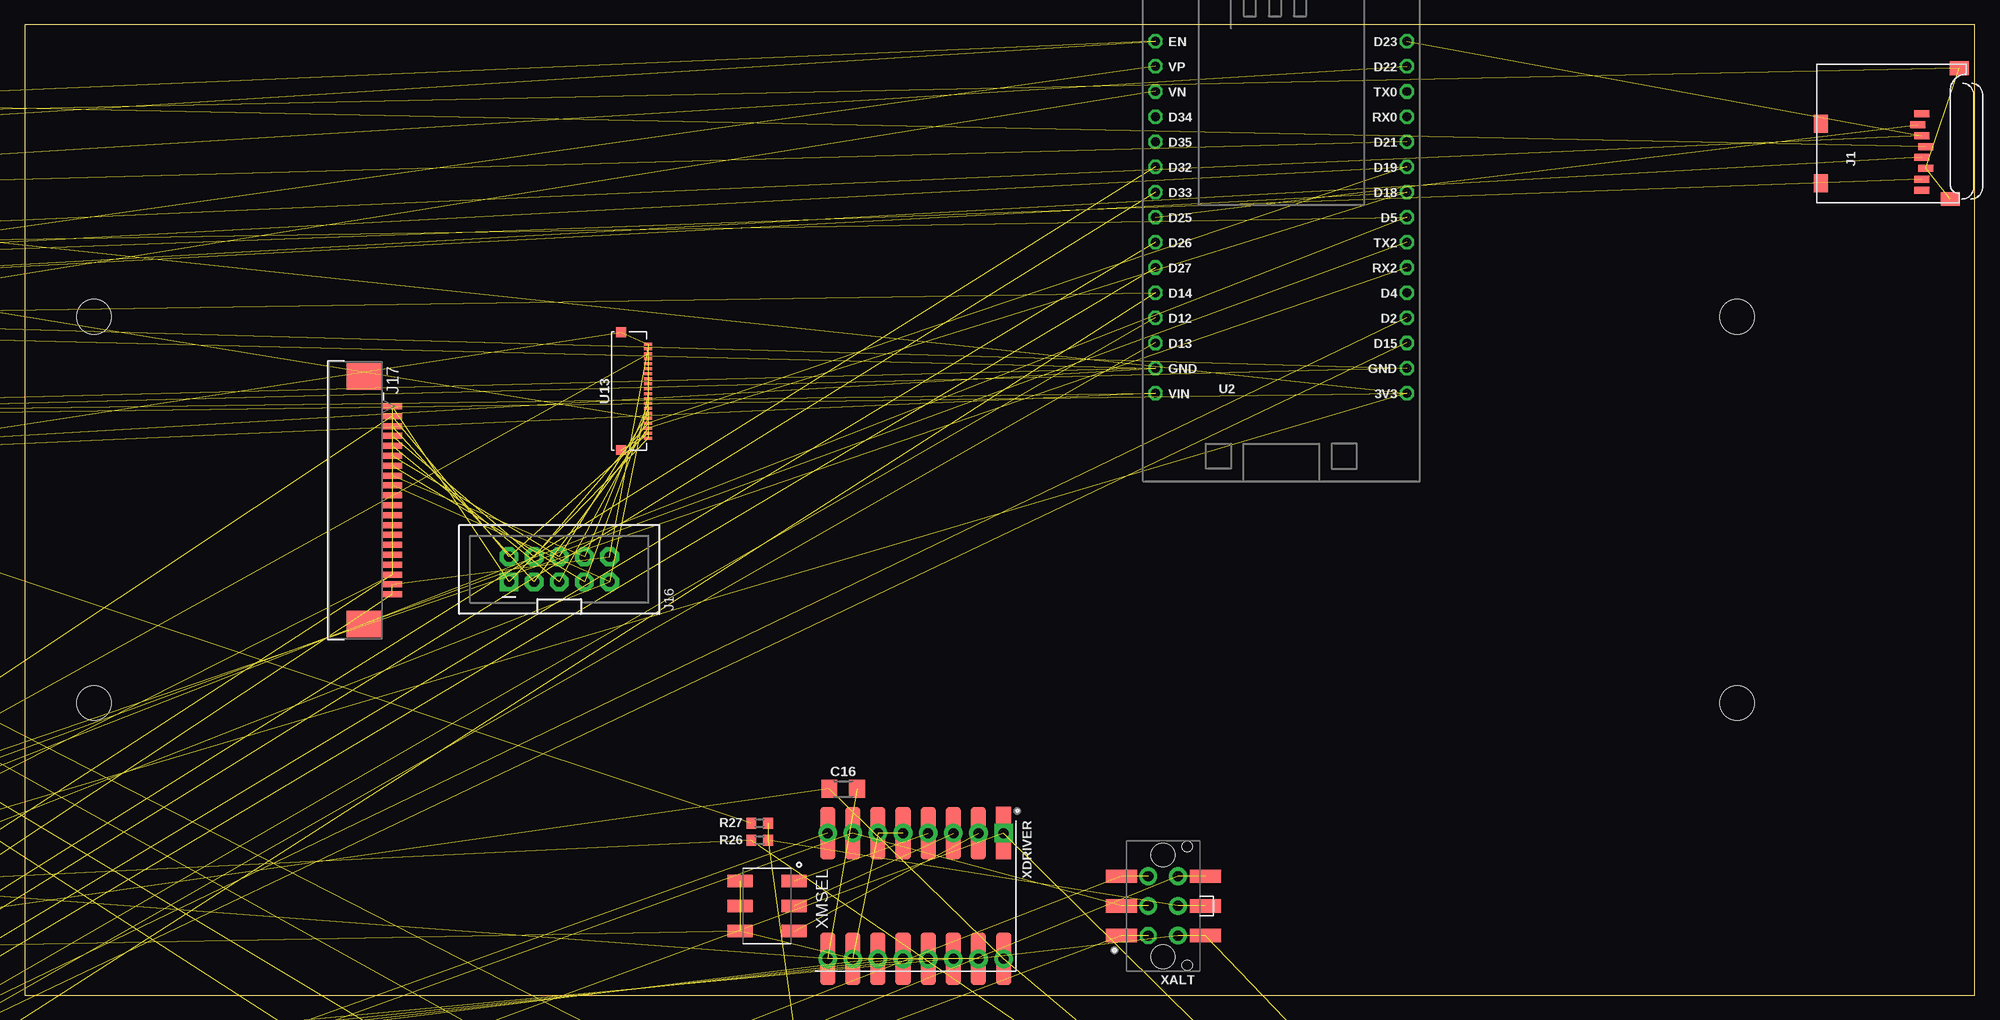
[diagram p3: board, top side]
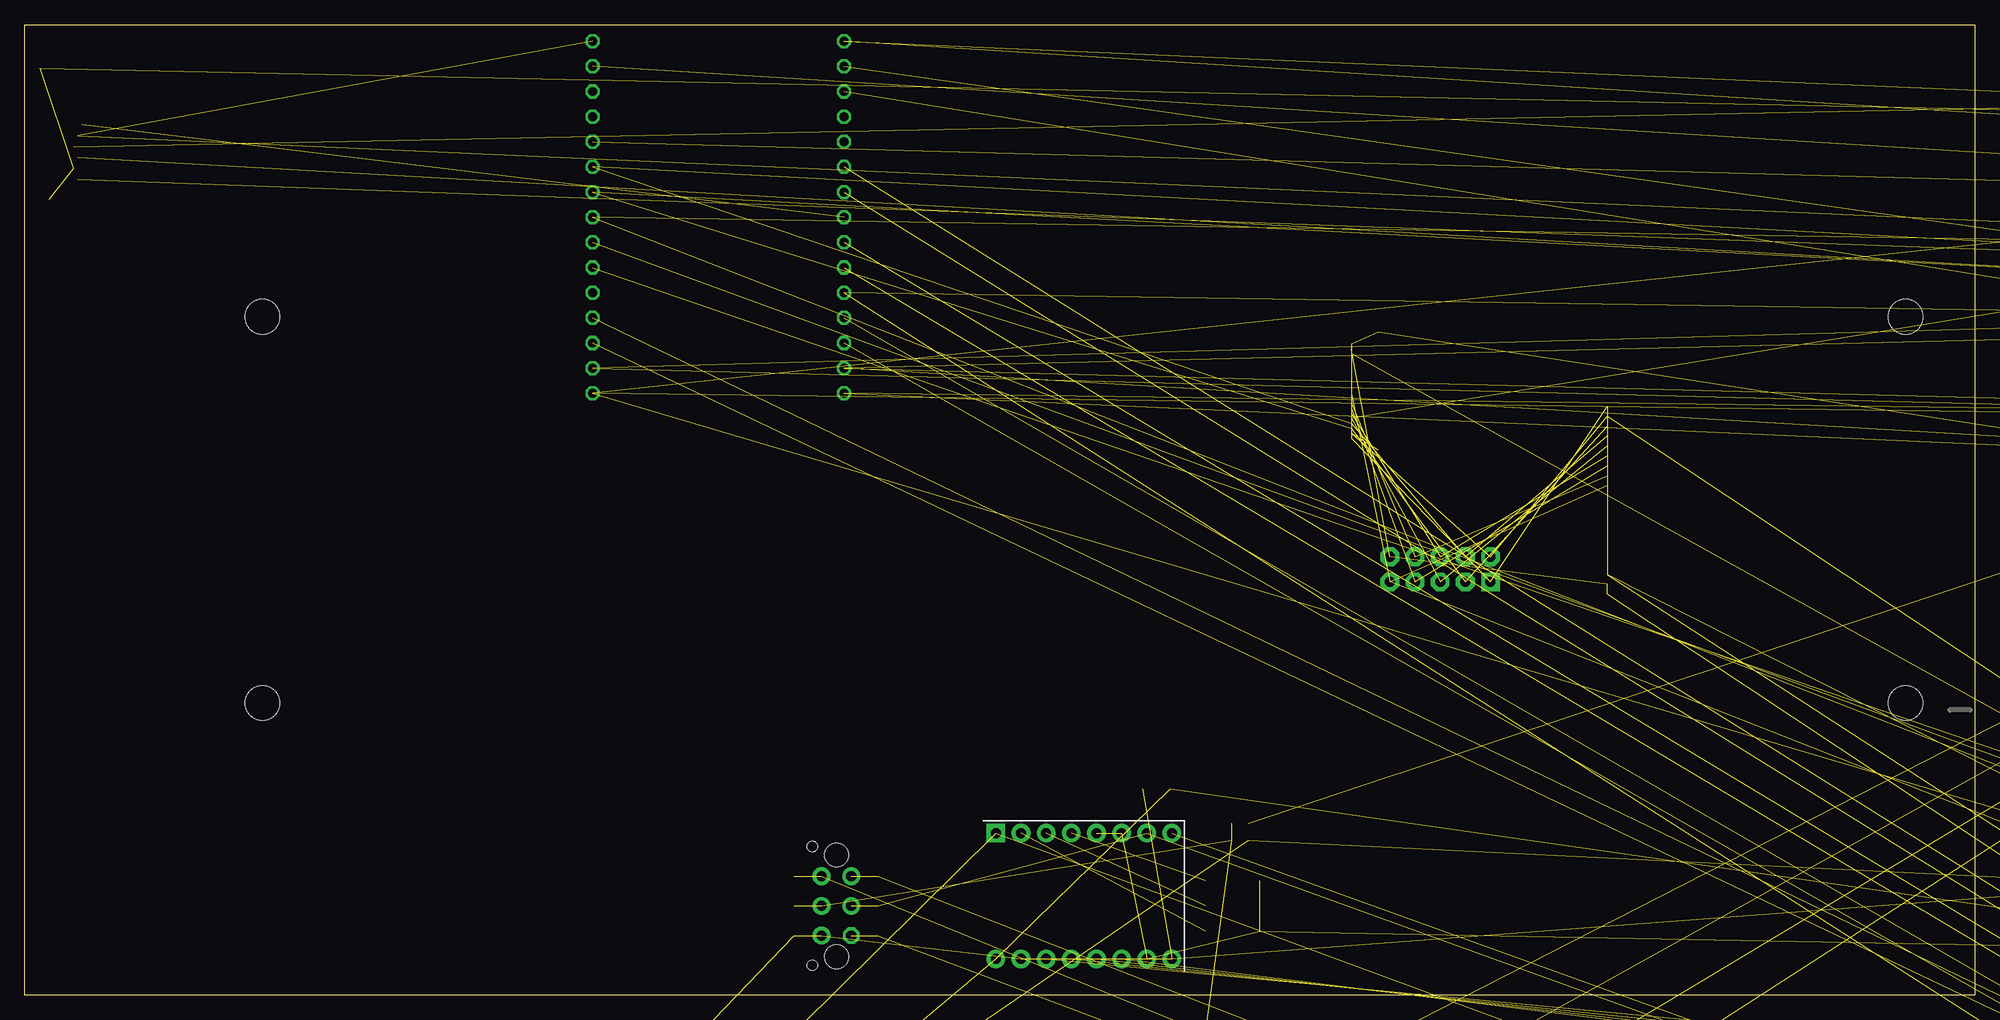
[diagram p4: board, bottom side, seen from below]

Size 197 x 98 mm. Coordinates in mm from the lower left corner, seen from the top.
Outline: 0,0 197,0 197,98 0,98 0,0
Copper layers (1*16): Top 0.035559375mm / dielectric 1.6mm / Bottom 0.035559375mm
Design rules "oshpark-2layer": minimum track width 6mil, minimum drill 10mil, track to track 6mil, track to pad 6mil, pad to pad 6mil, via to via 6mil, smd to smd 6mil, copper to edge 15mil, drill to drill 6mil, minimum pad ring 5mil, minimum via ring 5mil, stop-mask expansion 2.5mil, vias tented up to drill 0mil, thermal gap 10mil
Holes 3.2 mm at -118,5 -28,5 -28,95 -118,95
Holes 3.51 mm at 7,68.5 173,68.5 7,29.5 173,29.5
tKeepout: area -121.2,1.8 to -114.8,8.2; area -31.2,1.8 to -24.8,8.2; area -31.2,91.8 to -24.8,98.2; area -121.2,91.8 to -114.8,98.2; area 3.5,65 to 10.5,72; area 169.5,65 to 176.5,72; area 3.5,26 to 10.5,33; area 169.5,26 to 176.5,33

### Footprints (pad centres in the part's own frame; a part is rotated, then mirrored left to right if it is on the bottom)
MOLEX_430450614_430450615 = smd 1.27 x 3.175: 1 -3,4.192; 2 0,4.192; 3 3,4.192; 4 -3,-4.292; 5 0,-4.292; 6 3,-4.292 | drill 1.02 pad 1.676 octagon: 1_ -3,1.5 | drill 1.02 pad 1.778: 2_ 0,1.5; 3_ 3,1.5; 4_ -3,-1.5; 5_ 0,-1.5; 6_ 3,-1.5 | hole 2.41: 5.15,0; -5.13,0 | hole 1.02: 6,-2.44; -6,-2.44
IC_DRV8825_CARRIER_TH_SMD = drill 1.016 pad 1.88 square: 1 -6.35,8.89 | smd 5.3 x 1.524: 1_ -6.35,8.89; 2_ -6.35,6.35; 3_ -6.35,3.81; 4_ -6.35,1.27; 5_ -6.35,-1.27; 6_ -6.35,-3.81; 7_ -6.35,-6.35; 8_ -6.35,-8.89; 9_ 6.35,-8.89; 10_ 6.35,-6.35; 11_ 6.35,-3.81; 12_ 6.35,-1.27; 13_ 6.35,1.27; 14_ 6.35,3.81; 15_ 6.35,6.35; 16_ 6.35,8.89 | drill 1.016 pad 1.88: 2 -6.35,6.35; 3 -6.35,3.81; 4 -6.35,1.27; 5 -6.35,-1.27; 6 -6.35,-3.81; 7 -6.35,-6.35; 8 -6.35,-8.89; 9 6.35,-8.89; 10 6.35,-6.35; 11 6.35,-3.81; 12 6.35,-1.27; 13 6.35,1.27; 14 6.35,3.81; 15 6.35,6.35; 16 6.35,8.89
CONN-.100-2 = drill 1.016 pad 1.88 square: 1 0,0 | drill 1.016 pad 1.88: 2 2.54,0
CONN-.100-4 = drill 1.016 pad 1.88 square: 1 0,0 | drill 1.016 pad 1.88: 2 2.54,0; 3 5.08,0; 4 7.62,0
AMPHENOL_95278-101A06LF = smd 1.27 x 2.54: 1 -2.54,2.73; 2 -2.54,-2.73; 3 0,2.73; 4 0,-2.73; 5 2.54,2.73; 6 2.54,-2.73
TPTHRU = drill 1.016 pad 1.88: 1 0,0
C-0603 = smd 1.1 x 1: 1 -0.85,0; 2 0.85,0
C-1206 = smd 1.6 x 1.8: 1 -1.4,0; 2 1.4,0
C-E-6 = smd 3.5 x 1.4: + 2.65,0; - -2.65,0
LED-0603 = smd 0.8 x 0.8: A 0,-0.75; C 0,0.75
D-SOD323 = smd 1 x 0.8: A -1.2,0; C 1.2,0
D-SOD523 = smd 0.762 x 0.7: A -0.8,0; C 0.8,0
3557-2 = drill 1.6: 1@1 -6.731,-1.702; 1@2 -6.731,1.702; 2@1 6.731,-1.702; 2@2 6.731,1.702
FIDUCIAL-MICRO = smd 0.635 x 0.635: 1 0,0
SO20W = smd 0.66 x 2.032: 1 -5.715,-5.029; 2 -4.445,-5.029; 3 -3.175,-5.029; 4 -1.905,-5.029; 5 -0.635,-5.029; 6 0.635,-5.029; 7 1.905,-5.029; 8 3.175,-5.029; 9 4.445,-5.029; 10 5.715,-5.029; 11 5.715,5.029; 12 4.445,5.029; 13 3.175,5.029; 14 1.905,5.029; 15 0.635,5.029; 16 -0.635,5.029; 17 -1.905,5.029; 18 -3.175,5.029; 19 -4.445,5.029; 20 -5.715,5.029
CONN-MICROSD-2908-05WB-MG = smd 0.7 x 1.5: 1 9,-10.64; 2 7.9,-10.24; 3 6.8,-10.64; 4 5.7,-11.04; 5 4.6,-10.64; 6 3.5,-11.04; 7 2.4,-10.64; 8 1.3,-10.64 | smd 1.8 x 1.4: CD1 2,-0.44; CD2 8,-0.44 | smd 1.4 x 1.9: MT1 0.4,-13.54; MT2 13.6,-14.44
CONN-3.81MM-KF2EDG-6 = drill 1.3 square: 1 -9.525,0 | drill 1.3: 2 -5.715,0; 3 -1.905,0; 4 1.905,0; 5 5.715,0; 6 9.525,0
2X5-SHROUDED = drill 1.016 pad 1.88 square: 1 -1.27,5.08 | drill 1.016 pad 1.88 octagon: 2 1.27,5.08; 3 -1.27,2.54; 4 1.27,2.54; 5 -1.27,0; 6 1.27,0; 7 -1.27,-2.54; 8 1.27,-2.54; 9 -1.27,-5.08; 10 1.27,-5.08
CON20_SMT-RA_FCC-FPC2 = smd 0.61 x 2.007: 1 9.5,-1.118; 2 8.5,-1.118; 3 7.5,-1.118; 4 6.5,-1.118; 5 5.5,-1.118; 6 4.5,-1.118; 7 3.5,-1.118; 8 2.5,-1.118; 9 1.5,-1.118; 10 0.5,-1.118; 11 -0.5,-1.118; 12 -1.5,-1.118; 13 -2.5,-1.118; 14 -3.5,-1.118; 15 -4.5,-1.118; 16 -5.5,-1.118; 17 -6.5,-1.118; 18 -7.5,-1.118; 19 -8.5,-1.118; 20 -9.5,-1.118 | smd 2.667 x 3.607: 21 -12.509,1.689; 22 12.509,1.689
TO252 = smd 1 x 1.6: 1 -2.28,-4.8; 2 2.28,-4.8 | smd 5.4 x 6.2: 3 0,2.5
SOT23-3 = smd 0.8 x 0.972: 1 -0.95,-1; 2 0.95,-1; 3 0,1
R-0603 = smd 1 x 1.1: 1 -0.85,0; 2 0.85,0
CONN-.100-6 = drill 1.016 pad 1.88 square: 1 0,0 | drill 1.016 pad 1.88: 2 2.54,0; 3 5.08,0; 4 7.62,0; 5 10.16,0; 6 12.7,0
QFN28-ML_6X6MM = smd 0.7 x 0.35: 1 -2.7,1.95; 2 -2.7,1.3; 3 -2.7,0.65; 4 -2.7,0; 5 -2.7,-0.65; 6 -2.7,-1.3; 7 -2.7,-1.95; 15 2.7,-1.95; 16 2.7,-1.3; 17 2.7,-0.65; 18 2.7,0; 19 2.7,0.65; 20 2.7,1.3; 21 2.7,1.95 | smd 0.35 x 0.7: 8 -1.95,-2.7; 9 -1.3,-2.7; 10 -0.65,-2.7; 11 0,-2.7; 12 0.65,-2.7; 13 1.3,-2.7; 14 1.95,-2.7; 22 1.95,2.7; 23 1.3,2.7; 24 0.65,2.7; 25 0,2.7; 26 -0.65,2.7; 27 -1.3,2.7; 28 -1.95,2.7 | smd 3.7 x 3.7: EXP 0,0
ESP32_DEVKIT = drill 0.9 pad 1.422 octagon: 3V3 12.7,-17.78; D2 12.7,-10.16; D4 12.7,-7.62; D5 12.7,0; D12 -12.7,-10.16; D13 -12.7,-12.7; D14 -12.7,-7.62; D15 12.7,-12.7; D18 12.7,2.54; D19 12.7,5.08; D21 12.7,7.62; D22 12.7,15.24; D23 12.7,17.78; D25 -12.7,0; D26 -12.7,-2.54; D27 -12.7,-5.08; D32 -12.7,5.08; D33 -12.7,2.54; D34 -12.7,10.16; D35 -12.7,7.62; EN -12.7,17.78; GND@1 -12.7,-15.24; GND@2 12.7,-15.24; RX0 12.7,10.16; RX2 12.7,-5.08; TX0 12.7,12.7; TX2 12.7,-2.54; VIN -12.7,-17.78; VN -12.7,12.7; VP -12.7,15.24
VREG-SIP3 = drill 1.016 pad 1.88 square: 1 -2.54,0 | drill 1.016 pad 1.88: 2 0,0; 3 2.54,0
FCI_10051922-2010ELF = smd 0.3 x 0.82: 1 4.75,-0.41; 2 4.25,-0.41; 3 3.75,-0.41; 4 3.25,-0.41; 5 2.75,-0.41; 6 2.25,-0.41; 7 1.75,-0.41; 8 1.25,-0.41; 9 0.75,-0.41; 10 0.25,-0.41; 11 -0.25,-0.41; 12 -0.75,-0.41; 13 -1.25,-0.41; 14 -1.75,-0.41; 15 -2.25,-0.41; 16 -2.75,-0.41; 17 -3.25,-0.41; 18 -3.75,-0.41; 19 -4.25,-0.41; 20 -4.75,-0.41 | smd 1 x 1: G1 -5.95,2.3; G2 5.95,2.3
CONN-3.81MM-KF2EDG-2 = drill 1.3 square: 1 -1.905,0 | drill 1.3: 2 1.905,0

### Placement (x,y rotation side)
AALT  47,-100 90 top  (outside the outline)
ADRIVER  18,-96 90 top  (outside the outline)
ALIMIT  129,-103 90 top  (outside the outline)
AMOTOR  67,-103 90 top  (outside the outline)
AMSEL  65,-81 90 top  (outside the outline)
AUDIO  -126,-31 90 top  (outside the outline)
C1  175,-53 90 top  (outside the outline)
C2  -73,88 180 top  (outside the outline)
C3  -112,85 270 top  (outside the outline)
C4  -104,-68 90 top  (outside the outline)
C5  -112,79 270 top  (outside the outline)
C6  -103,-74 90 top  (outside the outline)
C7  -63,75.36 180 top  (outside the outline)
C8  -112,73 270 top  (outside the outline)
C9  180,-53 90 top  (outside the outline)
C10  -78,68 0 top  (outside the outline)
C11  -22,-68 90 top  (outside the outline)
C12  -112,67 270 top  (outside the outline)
C13  -21,-74 90 top  (outside the outline)
C14  -100.83,45.95 270 top  (outside the outline)
C15  -79.46,45.95 270 top  (outside the outline)
C16  82.68,20.83 0 top
C17  60,-68 90 top  (outside the outline)
C18  61,-74 90 top  (outside the outline)
C20  -86,-53 90 top  (outside the outline)
CYCLE  -118,55 270 top  (outside the outline)
D1  -78.97,51.95 270 top  (outside the outline)
D2  -116.41,34.39 270 top  (outside the outline)
D3  205,-102 90 top  (outside the outline)
D4  208,-102 90 top  (outside the outline)
D5  211,-102 90 top  (outside the outline)
D6  214,-102 90 top  (outside the outline)
D7  -217,-92 90 top  (outside the outline)
D8  -214,-92 90 top  (outside the outline)
D9  -211,-92 90 top  (outside the outline)
ESTOP  -142.89,-61.27 90 top  (outside the outline)
F1  -217.82,-22 90 top  (outside the outline)
FEED  -118,62 270 top  (outside the outline)
FID1  -120,97 0 top  (outside the outline)
FID2  -26,3 0 top  (outside the outline)
GND  -46.8,68.58 0 top  (outside the outline)
I2C  -105.36,62.56 90 top  (outside the outline)
IC1  -98,-48 90 top  (outside the outline)
J1  181,80 90 top
J2  193,-85 90 top  (outside the outline)
J3V3  -73.25,57.89 180 top  (outside the outline)
J5V0  -86.75,58.15 180 top  (outside the outline)
J16  54,43 90 top
J17  36.02,49.97 90 top
J24V0  -93.03,58.13 180 top  (outside the outline)
LED0  -90,95 180 top  (outside the outline)
LED1  -96,95 180 top  (outside the outline)
LED2  -102,95 180 top  (outside the outline)
LED3  -108,95 180 top  (outside the outline)
MISO  -46.8,73.66 0 top  (outside the outline)
MOSI  -46.8,76.2 0 top  (outside the outline)
Q1  -108.36,41.95 0 top  (outside the outline)
Q2  174,-63 90 top  (outside the outline)
Q3  174,-75 90 top  (outside the outline)
Q4  174,-87 90 top  (outside the outline)
Q5  174,-99 90 top  (outside the outline)
Q8  -40.45,11.43 90 top  (outside the outline)
Q9  -36.01,11.43 90 top  (outside the outline)
Q10  -44.88,11.43 90 top  (outside the outline)
R1  -63.31,90.81 180 top  (outside the outline)
R2  -109,89 180 top  (outside the outline)
R3  -103,89 180 top  (outside the outline)
R4  -97,89 180 top  (outside the outline)
R5  -91,89 180 top  (outside the outline)
R6  -78,88 0 top  (outside the outline)
R7  -64.36,82.73 180 top  (outside the outline)
R8  -94,-23 90 top  (outside the outline)
R9  -81,-53 90 top  (outside the outline)
R10  -99.72,70.41 0 top  (outside the outline)
R11  -99.72,67.69 0 top  (outside the outline)
R12  -111,62 0 top  (outside the outline)
R13  -111,59 0 top  (outside the outline)
R14  -111,55 0 top  (outside the outline)
R15  -111,52 0 top  (outside the outline)
R16  -82.97,51.95 180 top  (outside the outline)
R17  -114,39.95 0 top  (outside the outline)
R18  -85,-111 90 top  (outside the outline)
R19  -85,-107 90 top  (outside the outline)
R20  -85,-103 90 top  (outside the outline)
R21  -85,-99 90 top  (outside the outline)
R22  -85,-95 90 top  (outside the outline)
R23  -85,-91 90 top  (outside the outline)
R24  -32.52,11.43 270 top  (outside the outline)
R25  -30.16,11.43 270 top  (outside the outline)
R26  74.25,15.63 180 top
R27  74.25,17.36 180 top
R28  170,-53 90 top  (outside the outline)
R29  -130.95,-67.49 90 top  (outside the outline)
R30  -207,-111 90 top  (outside the outline)
R31  -177,-109 90 top  (outside the outline)
R32  -197,-109 90 top  (outside the outline)
R33  -192,-109 90 top  (outside the outline)
R34  -187,-109 90 top  (outside the outline)
R35  -182,-109 90 top  (outside the outline)
R36  -172,-109 90 top  (outside the outline)
R37  -167,-109 90 top  (outside the outline)
R38  -85,-87 90 top  (outside the outline)
R39  -85,-83 90 top  (outside the outline)
R40  -85,-79 90 top  (outside the outline)
R41  -85,-75 90 top  (outside the outline)
R42  -3,-111 90 top  (outside the outline)
R43  -3,-107 90 top  (outside the outline)
R44  -3,-103 90 top  (outside the outline)
R45  -3,-99 90 top  (outside the outline)
R46  -3,-95 90 top  (outside the outline)
R47  -3,-91 90 top  (outside the outline)
R48  -3,-87 90 top  (outside the outline)
R49  -3,-83 90 top  (outside the outline)
R50  -3,-79 90 top  (outside the outline)
R51  -3,-75 90 top  (outside the outline)
R52  79,-111 90 top  (outside the outline)
R53  79,-107 90 top  (outside the outline)
R54  79,-103 90 top  (outside the outline)
R55  79,-99 90 top  (outside the outline)
R56  79,-95 90 top  (outside the outline)
R57  79,-91 90 top  (outside the outline)
R58  79,-87 90 top  (outside the outline)
R59  79,-83 90 top  (outside the outline)
R60  79,-79 90 top  (outside the outline)
R61  79,-75 90 top  (outside the outline)
RESET  -28.02,61.6 90 top  (outside the outline)
SCK  -46.8,71.12 0 top  (outside the outline)
SPINDLE  -46.16,4.45 0 top  (outside the outline)
U1  -100,81 90 top  (outside the outline)
U2  126.94,78.56 0 top
U3  -90.46,42.95 0 top  (outside the outline)
U13  62.55,61 90 top
USER0  -118,87 270 top  (outside the outline)
USER1  -118,81 270 top  (outside the outline)
USER2  -118,75 270 top  (outside the outline)
USER3  -118,69 270 top  (outside the outline)
VIN  -117,45.95 270 top  (outside the outline)
XALT  115,9 90 top
XDRIVER  90,10 270 top
XLIMIT  91,-103 90 top  (outside the outline)
XMOTOR  -194.71,-31.27 90 top  (outside the outline)
XMSEL  75,9 270 top
YALT  -117,-100 90 top  (outside the outline)
YDRIVER  -146,-96 90 top  (outside the outline)
YLIMIT  110,-103 90 top  (outside the outline)
YMOTOR  -142,-81 180 top  (outside the outline)
YMSEL  -165,-96 270 top  (outside the outline)
ZALT  -35,-100 90 top  (outside the outline)
ZDRIVER  -64,-96 90 top  (outside the outline)
ZLIMIT  148,-103 90 top  (outside the outline)
ZMOTOR  -15,-103 90 top  (outside the outline)
ZMSEL  -17,-81 90 top  (outside the outline)

### Tracks (layer width: path | path; a pad name or v marks a point on that pad's centre or on a via)
3V3  (24 unrouted)
  pour Bottom: -121,2 -121,98 -86.64,98 -86.64,90 -55,90 -55,98 -25,98 -25,2
5V0  (36 unrouted)
24V0  (25 unrouted)
  pour Top: -107.76,43.18 -100.14,43.18 -105.22,15.24 -113.86,15.24 -113.86,2.54 -101.92,2.54 -101.92,6.1 -97.35,6.1 -97.35,2.54 -85.41,2.54 -85.41,6.1 -81.09,6.1 -81.09,2.54 -68.9,2.54 -68.9,6.1 -64.58,6.1 -64.58,2.54 -52.64,2.54 -52.64,5.84 -48.07,5.84 -48.07,2.54 -35.88,2.54 -35.88,6.1 -30.8,6.1 -30.8,0.25 -122.49,0.25 -122.49,34.29 -109.54,34.29
A_DIR  (1 unrouted)
A_DIR'  (2 unrouted)
A_STEP  (1 unrouted)
A_STEP'  (2 unrouted)
AUDIO  (3 unrouted)
CS_DISPLAY  (2 unrouted)
CS_SD  (1 unrouted)
CYCLE_START  (1 unrouted)
ESTOP  (6 unrouted)
FEED_HOLD  (1 unrouted)
GND  (90 unrouted)
  pour Top (rank 2): -121,2 -121,98 -86.64,98 -86.64,90 -55,90 -55,98 -25,98 -25,2
INT_DISPLAY  (2 unrouted)
MISO  (5 unrouted)
MOSI  (5 unrouted)
N$1  (2 unrouted)
N$2  (3 unrouted)
N$3  (1 unrouted)
N$5  (3 unrouted)
N$6  (2 unrouted)
N$7  (1 unrouted)
N$8  (1 unrouted)
N$9  (1 unrouted)
N$10  (2 unrouted)
N$11  (2 unrouted)
N$12  (1 unrouted)
N$13  (4 unrouted)
N$14  (2 unrouted)
N$15  (1 unrouted)
N$16  (2 unrouted)
N$17  (2 unrouted)
N$18  (2 unrouted)
N$19  (2 unrouted)
N$20  (2 unrouted)
N$21  (2 unrouted)
N$22  (1 unrouted)
N$23  (1 unrouted)
N$24  (2 unrouted)
N$25  (2 unrouted)
N$26  (1 unrouted)
N$27  (1 unrouted)
N$28  (1 unrouted)
N$29  (1 unrouted)
N$30  (2 unrouted)
N$31  (4 unrouted)
N$32  (2 unrouted)
N$33  (1 unrouted)
N$34  (1 unrouted)
N$35  (1 unrouted)
N$36  (3 unrouted)
N$37  (3 unrouted)
N$38  (3 unrouted)
N$39  (2 unrouted)
N$40  (1 unrouted)
N$41  (1 unrouted)
N$42  (1 unrouted)
N$43  (2 unrouted)
N$44  (2 unrouted)
N$45  (2 unrouted)
N$46  (2 unrouted)
N$47  (4 unrouted)
N$48  (3 unrouted)
N$49  (3 unrouted)
N$50  (3 unrouted)
N$51  (2 unrouted)
N$52  (1 unrouted)
N$53  (1 unrouted)
N$54  (1 unrouted)
N$55  (1 unrouted)
N$56  (2 unrouted)
N$57  (2 unrouted)
N$58  (4 unrouted)
N$59  (1 unrouted)
N$60  (3 unrouted)
N$61  (1 unrouted)
N$62  (2 unrouted)
N$63  (2 unrouted)
N$64  (1 unrouted)
N$65  (2 unrouted)
N$66  (2 unrouted)
N$67  (2 unrouted)
N$68  (4 unrouted)
N$69  (3 unrouted)
N$70  (3 unrouted)
N$71  (3 unrouted)
N$84  (1 unrouted)
N$108  (2 unrouted)
PD_DISPLAY  (2 unrouted)
RESET  (4 unrouted)
SCK  (5 unrouted)
SCL  (2 unrouted)
SDA  (2 unrouted)
SPINDLE_DIR  (1 unrouted)
SPINDLE_ENABLE  (3 unrouted)
SPINDLE_PWM  (1 unrouted)
USER0  (2 unrouted)
USER1  (2 unrouted)
USER2  (2 unrouted)
USER3  (2 unrouted)
X_DIR  (1 unrouted)
X_DIR'  (2 unrouted)
X_LIMIT  (8 unrouted)
X_STEP  (1 unrouted)
X_STEP'  (14 unrouted)
X_STEP'1  (3 unrouted)
X_STEP_5V4  (2 unrouted)
Y_DIR  (1 unrouted)
Y_DIR'  (2 unrouted)
Y_STEP  (1 unrouted)
Y_STEP'  (2 unrouted)
Z_DIR  (1 unrouted)
Z_DIR'  (2 unrouted)
Z_STEP  (1 unrouted)
Z_STEP'  (2 unrouted)

### Text on the board
tDocu: 8-24VDC | 5.0V | tetrad / 191101 / v1.0